# EAGLE design ales_v2_noosc (EAGLE 7.6.0)
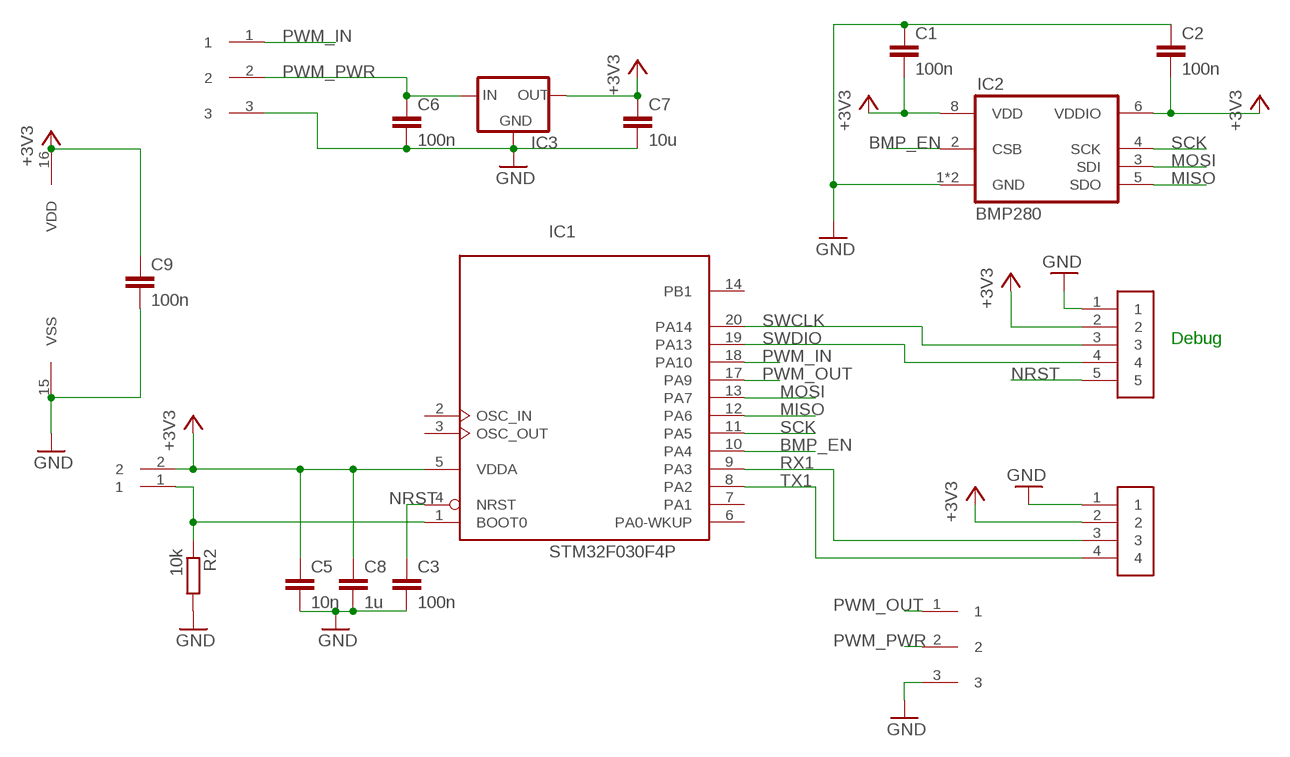
[diagram p0: schematic, sheet 1]

## Parts
BOOT  SMD_CONN1X2  [CONN_SMD1X2]
C1  100n  C-EUC0603K  [C0603K]
C2  100n  C-EUC0603K  [C0603K]
C3  100n  C-EUC0603K  [C0603K]
C5  10n  C-EUC0603K  [C0603K]
C6  100n  C-EUC0603K  [C0603K]
C7  10u  C-EUC0603K  [C0603K]
C8  1u  C-EUC0603K  [C0603K]
C9  100n  C-EUC0603K  [C0603K]
IC1  STM32F030F4P  [TSSOP20-I]
IC2  BMP280  [BMP280]
IC3  XC63FPM  [SOT23]
R2  10k  R-EU_R0603  [R0603]
U$2  CONN1X3  [CONN1X3]
U$3  CONN1X3  [CONN1X3]
U$4  CONN1X4  [CONN1X4]
U$6  CONN1X5  [CONN1X5]

## Nets
+3V3: BOOT.2 C1.2 C2.2 C5.1 C7.1 C8.1 C9.1 IC1.5(VDDA) IC1.16(VDD) IC2.6(VDDIO) IC2.8(VDD) IC3.1(OUT) U$4.2 U$6.2
BMP_EN: IC1.10(PA4) IC2.2(CSB)
BOOT0: BOOT.1 IC1.1(BOOT0) R2.1
GND: C1.1 C2.1 C3.2 C5.2 C6.2 C7.2 C8.2 C9.2 IC1.15(VSS) IC2.1(GND) IC2.7(GND) IC3.3(GND) R2.2 U$2.3 U$3.3 U$4.1 U$6.1
MISO: IC1.12(PA6) IC2.5(SDO)
MOSI: IC1.13(PA7) IC2.3(SDI)
NRST: C3.1 IC1.4(NRST) U$6.5
PWM_IN: IC1.18(PA10) U$3.1
PWM_OUT: IC1.17(PA9) U$2.1
PWM_PWR: C6.1 IC3.2(IN) U$2.2 U$3.2
RX1: IC1.9(PA3) U$4.3
SCK: IC1.11(PA5) IC2.4(SCK)
SWCLK: IC1.20(PA14) U$6.3
SWDIO: IC1.19(PA13) U$6.4
TX1: IC1.8(PA2) U$4.4
Unconnected: IC1.2(OSC_IN) IC1.3(OSC_OUT) IC1.6(PA0-WKUP) IC1.7(PA1) IC1.14(PB1)

## Notes on the sheet
- Debug

## Library data of the parts
BOOT = kieran:SMD_CONN1X2
C1-C3 C5-C9 = rcl:C-EU: CAPACITOR, European symbol
IC1 = micro-stm_v3:STM32F030F*P: ARM 32-bit Cortex™-M0 CPU 48 MHz maximum frequency 16 Kbytes of Flash memory 4 kbytes of SRAM 15 GPIOs 2.4 to 3.6 V application supply
IC2 = bosch-bmp280:BMP280: The BMP280 is an absolute barometric pressure sensor especially designed for mobile applications. The sensor module is housed in an extremely compact 8-pin metal-lid LGA package with a footprint of only 2.0 × 2.5 mm2 and 0.95 mm package height. Its small dimensions and its low power consumption of 2.7 μA @1Hz allow the implementation in battery driven devices such as mobile phones, GPS modules or watches. The library has been designed by Richard Magdycz <https://www.facebook.com/groups/eaglecadsoftUK>
IC3 = v-reg:XC63FP: Positiv Voltage Regulators www.torex.co.jp/english/product/pro02/pdf/0201_xc62fp.pdf
R2 = rcl:R-EU_: RESISTOR, European symbol
U$2 U$3 = kieran:CONN1X3
U$4 = kieran:CONN1X4
U$6 = kieran:CONN1X5

## Board
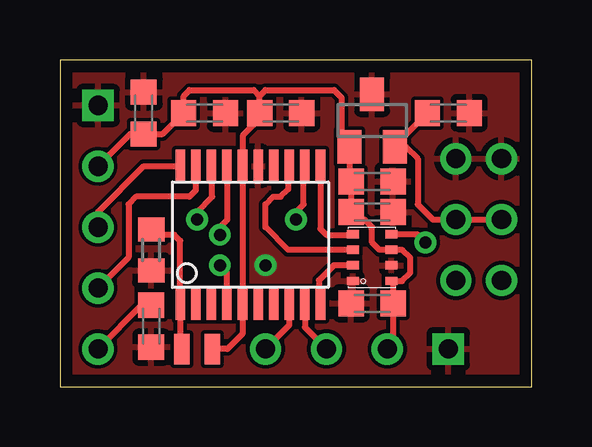
[diagram p1: board, top side]
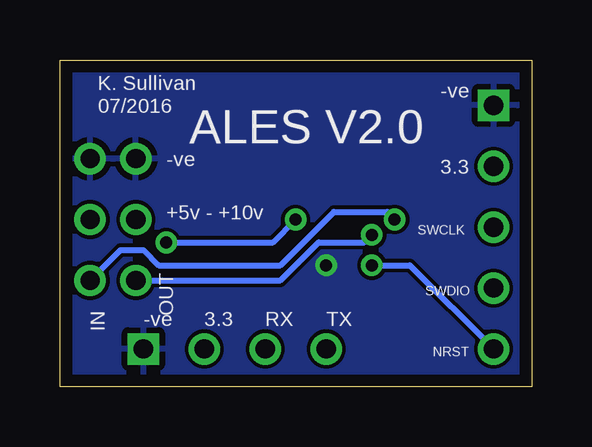
[diagram p2: board, bottom side, seen from below]

Size 19.67 x 13.64 mm. Coordinates in mm from the lower left corner, seen from the top.
Outline: 0,0 19.67,0 19.67,13.64 0,13.64 0,0
Copper layers (1*16): Top 0.035mm / dielectric 1.5mm / Bottom 0.035mm
Design rules "default *": minimum track width 10mil, minimum drill 13mil, track to track 6mil, track to pad 6mil, pad to pad 6mil, via to via 6mil, smd to smd 6mil, copper to edge 20mil, drill to drill 6mil, minimum pad ring 10mil, minimum via ring 8mil, stop-mask expansion 4mil, vias tented up to drill 0mil, thermal gap 10mil

### Footprints (pad centres in the part's own frame; a part is rotated, then mirrored left to right if it is on the bottom)
CONN_SMD1X2 = smd 1.27 x 0.635: 1 0,0.635; 2 0,-0.635
C0603K = smd 1.05 x 1.08: 1 -0.875,0; 2 0.875,0
TSSOP20-I = smd 0.4 x 1.35: 1 -2.925,-2.875; 2 -2.275,-2.875; 3 -1.625,-2.875; 4 -0.975,-2.875; 5 -0.325,-2.875; 6 0.325,-2.875; 7 0.975,-2.875; 8 1.625,-2.875; 9 2.275,-2.875; 10 2.925,-2.875; 11 2.925,2.875; 12 2.275,2.875; 13 1.625,2.875; 14 0.975,2.875; 15 0.325,2.875; 16 -0.325,2.875; 17 -0.975,2.875; 18 -1.625,2.875; 19 -2.275,2.875; 20 -2.925,2.875
BMP280 = smd 0.35 x 0.5: 1 0.975,-0.8; 2 0.325,-0.8; 3 -0.325,-0.8; 4 -0.975,-0.8; 5 -0.975,0.8; 6 -0.325,0.8; 7 0.325,0.8; 8 0.975,0.8
SOT23 = smd 1 x 1.4: 1 -0.95,-1.1; 2 0.95,-1.1; 3 0,1.1
R0603 = smd 1 x 1.1: 1 -0.85,0; 2 0.85,0
CONN1X3 = drill 0.8: 1 0,2.54; 2 0,0; 3 0,-2.54
CONN1X4 = drill 0.8 square: 1 0,1.27 | drill 0.8: 2 0,-1.27; 3 0,-3.81; 4 0,-6.35
CONN1X5 = drill 0.8 square: 1 0,1.27 | drill 0.8: 2 0,-1.27; 3 0,-3.81; 4 0,-6.35; 5 0,-8.89

### Placement (x,y rotation side)
BOOT  5.71,1.59 90 top
C1  13.02,3.49 0 top
C2  13.02,7.3 180 top
C3  3.81,2.54 270 top
C5  3.49,11.43 90 top
C6  16.19,11.43 0 top
C7  13.02,8.57 0 top
C8  6.03,11.43 0 top
C9  9.21,11.43 0 top
IC1  7.94,6.35 0 top
IC2  13.02,5.4 270 top
IC3  13.02,11.11 0 top
R2  3.81,5.71 270 top
U$2  16.51,6.98 180 top
U$3  18.41,6.98 180 top
U$4  14.92,1.59 270 top
U$6  1.59,10.48 0 top

### Tracks (layer width: path | path; a pad name or v marks a point on that pad's centre or on a via)
+3V3
  Top 0.254: 8.33,12.14 C9.1 8.33,11.19 7.62,10.48 7.62,9.23 | 8.33,12.14 8.57,12.38 11.43,12.38 11.75,12.06 11.75,10.33 IC3.1 12.07,8.65 C7.1 C2.2 12.46,6.98 12.7,6.98 13.02,6.67 13.02,6.03 13.33,5.72 IC2.6 14.29,5.71 14.6,5.4 14.6,4.76 14.26,4.42 IC2.8 13.89,4.42 C1.2 13.89,1.83 U$4.2 | 7.62,9.23 IC1.16 | BOOT.2 6.98,1.59 7.61,2.21 IC1.5 7.62,3.48 7.62,9.23 | 8.33,12.14 8.09,12.38 5.4,12.38 5.16,12.14 C8.1 4.28,10.55 C5.1 2.94,10.55 U$6.2
BMP_EN
  Top 0.254: IC2.2 11.42,5.07 10.8,4.45 10.8,3.54 IC1.10
BOOT0
  Top 0.254: BOOT.1 5.01,1.66 IC1.1 5.01,6.1 4.76,6.35 4.03,6.35 R2.1
GND  (via drill 0.5 pad 0.25)
  other vias: 8.57,5.08
  pour Bottom: 0,0 19.69,0 19.69,13.65 0,13.65
  pour Top: 0,0 19.69,0 19.69,13.65 0,13.65
MISO  (via drill 0.5 pad 0.25)
  Top 0.254: IC2.5 14.9,6.37 v15.24,6.03 | v9.84,6.98 9.84,7.3 10.16,7.62 10.16,9.17 IC1.12
  Bottom 0.254: v15.24,6.03 10.8,6.03 v9.84,6.98
MOSI
  Top 0.254: IC2.3 9.52,5.72 8.57,6.67 8.57,7.62 8.89,7.94 9.21,7.94 9.53,8.26 9.53,9.19 IC1.13
NRST  (via drill 0.5 pad 0.25)
  Top 0.254: IC1.4 6.96,4.79 v6.67,5.08 | C3.1 3.41,3.41 U$6.5
  Bottom 0.254: v6.67,5.08 5.08,5.08 U$6.5
PWM_IN  (via drill 0.5 pad 0.25)
  Top 0.254: v5.72,6.98 5.72,7.3 6.35,7.94 6.35,9.19 IC1.18
  Bottom 0.254: U$3.1 17.15,5.71 16.19,5.71 15.56,5.08 10.48,5.08 8.25,7.3 6.03,7.3 v5.72,6.98
PWM_OUT  (via drill 0.5 pad 0.25)
  Top 0.254: v6.67,6.35 6.67,6.67 6.98,6.98 6.98,9.2 IC1.17
  Bottom 0.254: U$2.1 10.48,4.45 8.89,6.03 6.98,6.03 v6.67,6.35
PWM_PWR
  Top 0.254: C6.1 13.97,10.08 IC3.2 14.44,10.01 14.92,9.53 14.92,7.62 15.56,6.98 U$2.2 U$3.2
RX1
  Top 0.254: IC1.9 10.21,2.49 U$4.3
SCK
  Top 0.254: IC1.11 10.86,6.6 11.11,6.35 12.19,6.35 IC2.4
SWCLK
  Top 0.254: U$6.3 1.59,7.3 3.49,9.21 4.99,9.21 IC1.20
SWDIO
  Top 0.254: IC1.19 5.66,8.2 5.4,7.94 3.17,7.94 2.86,7.62 2.86,5.4 U$6.4
TX1
  Top 0.254: IC1.8 9.56,2.58 U$4.4

### Text on the board
bPlace: -ve | 07/2016 | K. Sullivan | ALES V2.0 | 3.3 | -ve | +5v - +10v | SWCLK | OUT | SWDIO | TX | RX | 3.3 | -ve | IN | NRST